# EAGLE schematic untitled (EAGLE 5.10)
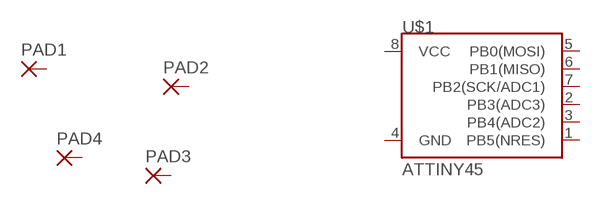
[diagram p0: schematic, sheet 1]

## Parts
PAD1  3,81/1,3  [3,81/1,3]
PAD2  3,81/1,3  [3,81/1,3]
PAD3  3,81/1,3  [3,81/1,3]
PAD4  3,81/1,3  [3,81/1,3]
U$1  ATTINY45  [SO08-EIAJ]
Unconnected: PAD1.1(P) PAD2.1(P) PAD3.1(P) PAD4.1(P) U$1.1(PB5(NRES)) U$1.2(PB3(ADC3)) U$1.3(PB4(ADC2)) U$1.4(GND) U$1.5(PB0(MOSI)) U$1.6(PB1(MISO)) U$1.7(PB2(SCK/ADC1)) U$1.8(VCC)

## Library data of the parts
PAD1-PAD4 = wirepad:3,81/1,3: THROUGH-HOLE PAD
U$1 = SparkFun:ATTINY45: Atmel ATTiny45